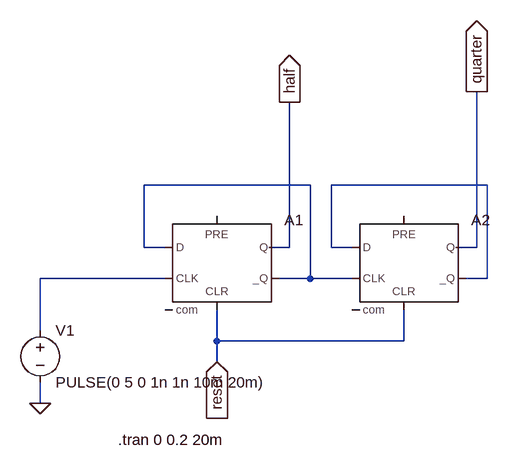
[diagram p0: schematic D FLİP FLOP.asc]
D FLİP FLOP.asc, the LTspice schematic file:
Version 4
SHEET 1 1176 680
WIRE 384 -96 128 -96
WIRE 656 -96 416 -96
WIRE 128 0 128 -96
WIRE 160 0 128 0
WIRE 352 0 352 -224
WIRE 352 0 320 0
WIRE 416 0 416 -96
WIRE 448 0 416 0
WIRE 640 0 640 -240
WIRE 640 0 608 0
WIRE 160 48 -32 48
WIRE 384 48 384 -96
WIRE 384 48 336 48
WIRE 448 48 384 48
WIRE 656 48 656 -96
WIRE 656 48 624 48
WIRE -32 128 -32 48
WIRE 240 144 240 96
WIRE 528 144 528 96
WIRE 528 144 240 144
WIRE 240 176 240 144
WIRE -32 240 -32 208
FLAG -32 240 0
FLAG 352 -224 half
IOPIN 352 -224 Out
FLAG 640 -240 quarter
IOPIN 640 -240 Out
FLAG 240 176 reset
IOPIN 240 176 In
SYMBOL voltage -32 112 R0
WINDOW 123 0 0 Left 0
WINDOW 39 0 0 Left 0
SYMATTR InstName V1
SYMATTR Value PULSE(0 5 0 1n 1n 10m 20m)
SYMBOL Digital\\dflop 240 -48 R0
SYMATTR InstName A1
SYMBOL Digital\\dflop 528 -48 R0
SYMATTR InstName A2
TEXT 88 296 Left 2 !.tran 0 0.2 20m

The netlist it stands for:
* D FLİP FLOP.asc
V1 N003 0 PULSE(0 5 0 1n 1n 10m 20m)
A1 N001 0 N003 0 reset N001 half 0 DFLOP
A2 N002 0 N001 0 reset N002 quarter 0 DFLOP
.tran 0 0.2 20m
.backanno
.end

* Results of the author's LTspice run, read from the files saved beside the schematic
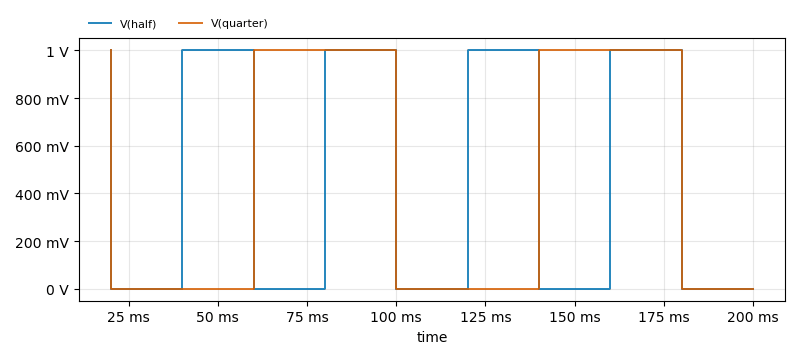
[diagram p1: Transient Analysis of D FLİP FLOP.asc, plotted from the saved traces]
* Transient Analysis, 1 run:
*   V(half): min 0 V, max 1 V, average 444.4 mV, rms 666.7 mV, last 0 V
*   V(quarter): min 0 V, max 1 V, average 444.4 mV, rms 666.7 mV, last 0 V